# Altium schematic sheet MDL-485.SchDoc
size A4; DocumentNumber: 4; SheetNumber: 4
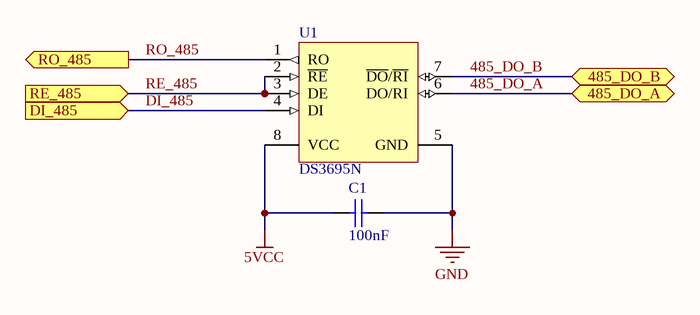
[diagram p0: MDL-485.SchDoc]

## Parts
C1  value 100nF  [VP44-2.5]  (hidden comment: VP44BY224JB)
U1  DS3695N  [N08E]

## Ports
485_DO_A (bidir), 485_DO_B (bidir), DI_485 (in), RE_485 (in), RO_485 (out)

## Nets
5VCC: C1.1 U1.8(VCC)
GND: C1.2 U1.5(GND)
485_DO_A: U1.6(DO/RI) ; port 485_DO_A
485_DO_B: U1.7(~{DO}/~{RI}) ; port 485_DO_B
DI_485: U1.4(DI) ; port DI_485
RE_485: U1.2(~{RE}) U1.3(DE) ; port RE_485
RO_485: U1.1(RO) ; port RO_485

## Library data of the parts
C1 = VP44BY224JB: Dipped Radial Multilayer Ceramic Capacitor X7R: 220nF, 100V; Published: 17-Dec-2003; DatasheetDocument: 4-Feb-2002; PackageDocument: 4-Feb-2002; PackageReference: VP44-2.5; Publisher: Altium Limited; ComponentLink1Description: Manufacturer Link; ComponentLink1URL: http://www.vishay.com/
U1 = DS3695N: Multipoint RS485/RS422 Transceiver/Repeater; Manufacturer: National Semiconductor; CompType: Interface IC; PackageTopMarking: NSUZXYTT*DS3695N; PowerWise: N; Published: 4-Dec-2008; DatasheetVersion: May-1998; PackageVersion: revG, May-2006; PackageReference: N08E; Publisher: Altium Limited; PackageDescription: MDIP, .365 x .250 x .130in, 8 Lead, .100in Pitch; PartNumber: DS3695N; RoHS: O; PinCount: 8; DigiKeyPartNumber: DS3695N-ND; Code_JEDEC: MS-001-BA; ComponentLink1Description: DS3695 Datasheet; ComponentLink1URL: http://www.national.com/ds/DS/DS3695.pdf; ComponentLink2Description: DS3695 Web Page; ComponentLink2URL: http://www.national.com/pf/DS/DS3695.html; ComponentLink3Description: N08E Package Page; ComponentLink3URL: http://www.national.com/packaging/folders/n08e.html